# Altium schematic sheet RC Transmitter Backend.SchDoc
size A; SheetNumber: 1; SheetTotal: 3
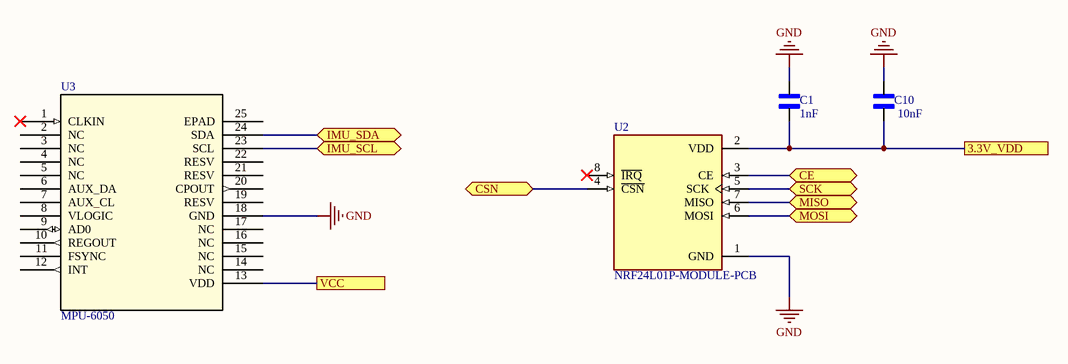
[diagram p0: RC Transmitter Backend.SchDoc]

## Parts
C1  1nF  [CAPC1005X55N]
C10  10nF  [CAPC0603X33N]
U2  NRF24L01P-MODULE-PCB  [XCVR_NRF24L01P-MODULE-PCB]
U3  MPU-6050  [QFN24_4X4X0P9-0P5_TDK-L]

## Ports
3.3V_VDD (see RC Transmitter Frontend[2A]), CE (bidir, see RC Transmitter Frontend[3C]), CSN (bidir, see RC Transmitter Frontend[3C]), IMU_SCL (bidir, see RC Transmitter Frontend[2B]), IMU_SDA (bidir, see RC Transmitter Frontend[2B]), MISO (bidir, see RC Transmitter Frontend[2C]), MOSI (bidir, see RC Transmitter Frontend[2C]), SCK (bidir, see RC Transmitter Frontend[2C]), VCC (see RC Transmitter Frontend[1B], RC Transmitter Frontend[1C], RC Transmitter Frontend[2D], RC Transmitter Frontend[3A], RC Transmitter Frontend[3B], RC Transmitter Frontend[4A])

## Nets
GND: C1.2 C10.2 U2.1(GND) U3.18(GND)
3.3V_VDD: C1.1 C10.1 U2.2(VDD) ; port 3.3V_VDD
CE: U2.3(CE) ; port CE
CSN: U2.4(~{CSN}) ; port CSN
IMU_SCL: U3.23(SCL) ; port IMU_SCL
IMU_SDA: U3.24(SDA) ; port IMU_SDA
MISO: U2.7(MISO) ; port MISO
MOSI: U2.6(MOSI) ; port MOSI
SCK: U2.5(SCK) ; port SCK
VCC: U3.13(VDD) ; port VCC

Not connected (* = marked no-connect by the designer): U2 8(~{IRQ})*; U3 1(CLKIN)* 2(NC) 3(NC) 4(NC) 5(NC) 6(AUX_DA) 7(AUX_CL) 8(VLOGIC) 9(AD0) 10(REGOUT) 11(FSYNC) 12(INT) 14(NC) 15(NC) 16(NC) 17(NC) 19(RESV) 20(CPOUT) 21(RESV) 22(RESV) 25(EPAD)

## Library data of the parts
C1 = GRM155R61A102KA01D: SMD-ÐºÐ¾Ð½Ð´ÐµÐ½ÑÐ°Ñ‚Ð¾Ñ€ X5R(EIA) Ñ Ñ‘Ð¼ÐºÐ¾ÑÑ‚ÑŒÑŽ 1000 Ð¿Ð¤, Ð´Ð¾Ð¿ÑƒÑÐº 10 %. ÐÐ¾Ð¼Ð¸Ð½Ð°Ð»ÑŒÐ½Ð¾Ðµ Ð½Ð°Ð¿Ñ€ÑÐ¶ÐµÐ½Ð¸Ðµ: 10 Ð’ Ð¿Ð¾ÑÑ‚Ð¾ÑÐ½Ð½Ð¾Ð³Ð¾ Ñ‚Ð¾ÐºÐ°; MF: Murata Electronics; SnapEDA_Link: https://www.snapeda.com/parts/GRM155R61A102KA01D/Murata+Electronics+North+America/view-part/?ref=snap; Package: 1005-2 Murata; Value: *; MP: GRM155R61A102KA01D; Check_prices: https://www.snapeda.com/parts/GRM155R61A102KA01D/Murata+Electronics+North+America/view-part/?ref=eda
C10 = GRM033R71A103KA01D: 10000 pF Â±10% 10V Ceramic Capacitor X7R 0201 (0603 Metric); MF: Murata; SnapEDA_Link: https://www.snapeda.com/parts/GRM033R71A103KA01D/Murata/view-part/?ref=snap; Package: 0603 Murata; Value: *; MP: GRM033R71A103KA01D; Check_prices: https://www.snapeda.com/parts/GRM033R71A103KA01D/Murata/view-part/?ref=eda; ComponentLink1Description: New link; ComponentLink1URL: *
U2 = NRF24L01P-MODULE-PCB: - Transceiver For Use With nRF24L01+; MF: Nordic Semiconductor; Package: None; MP: NRF24L01P-MODULE-PCB; Value: *; Availability: Bad; Price: None; SnapEDA_Link: https://www.snapeda.com/parts/NRF24L01P-MODULE-PCB/Nordic%20Semiconductor%20ASA/view-part/230534/?ref=snap; Mouser-Purchase-URL: https://snapeda.com/shop?store=Mouser&id=230534
U3 = MPU-6050: Description; Manufacturer_Name: TDK; Type: Motion Sensors; Copyright: Copyright (C) 2025 Ultra Librarian. All rights reserved.; Manufacturer_Part_Number: MPU-6050; RefDes: RefDes